# EAGLE design knuckleboard (EAGLE 6.1)
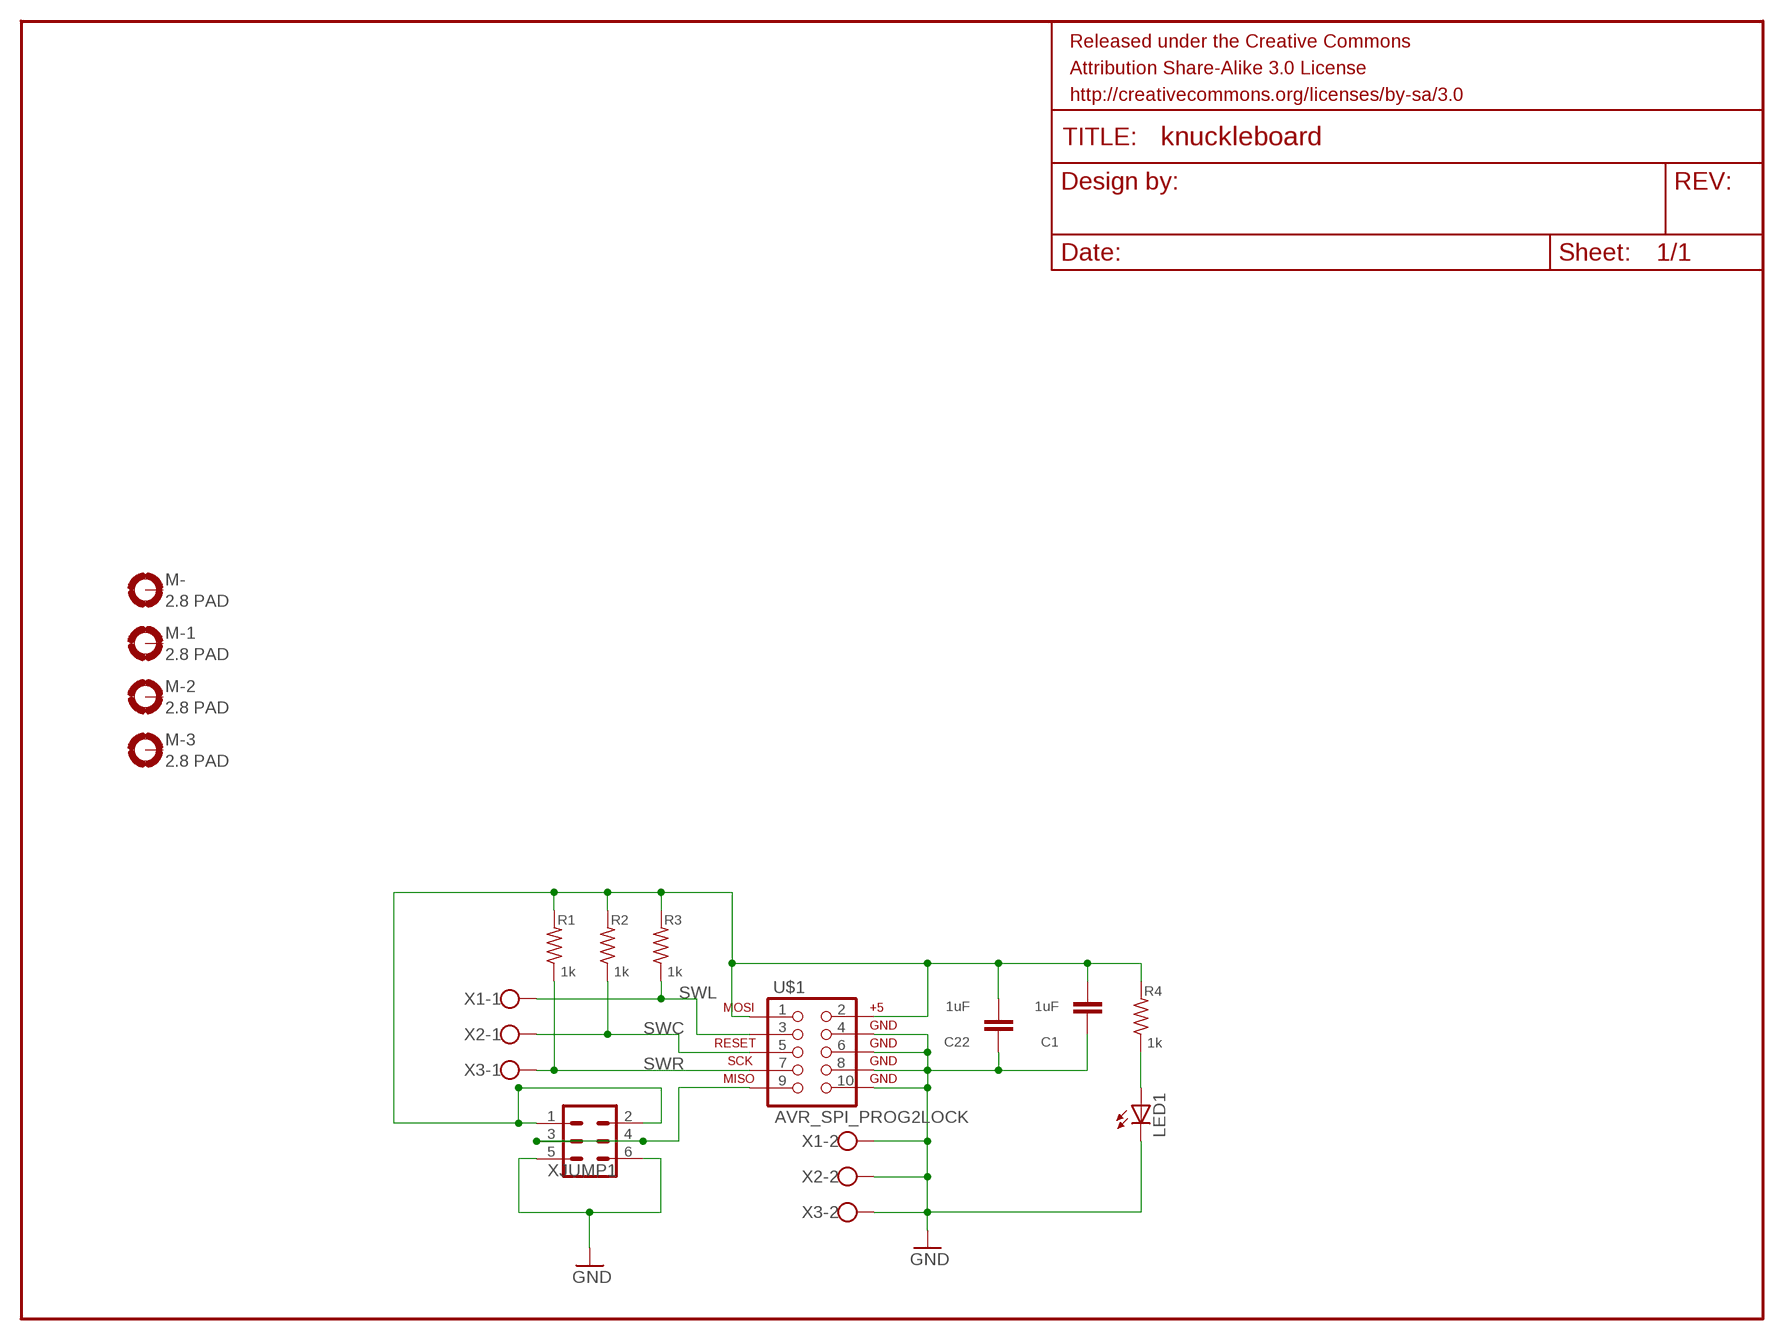
[diagram p0: schematic, sheet 1]

## Parts
C1  1uF  C-EUC1206  [C1206]
C22  1uF  C-EUC1206  [C1206]
LED1  LEDCHIPLED_1206  [CHIPLED_1206]
M-  2.8 PAD  MOUNT-PAD-ROUND2.8  [2,8-PAD]
M-1  2.8 PAD  MOUNT-PAD-ROUND2.8  [2,8-PAD]
M-2  2.8 PAD  MOUNT-PAD-ROUND2.8  [2,8-PAD]
M-3  2.8 PAD  MOUNT-PAD-ROUND2.8  [2,8-PAD]
R1  1k  R-US_M1206  [M1206]
R2  1k  R-US_M1206  [M1206]
R3  1k  R-US_M1206  [M1206]
R4  1k  R-US_M1206  [M1206]
U$1  AVR_SPI_PROG2LOCK  [2X5-SHROUDED_LOCK]
X1  W237-102  [W237-102]
X2  W237-102  [W237-102]
X3  W237-102  [W237-102]
XJUMP1  MA03-2  [MA03-2]

## Nets
GND: C1.1 C22.1 LED1.C U$1.4 U$1.6 U$1.8 U$1.10 X1.2 X2.2 X3.2 XJUMP1.5 XJUMP1.6
N$1: LED1.A R4.1
N$6: U$1.9 XJUMP1.3 XJUMP1.4
SWC: R2.1 U$1.5 X2.1
SWL: R3.1 U$1.3 X1.1
SWR: R1.1 U$1.7 X3.1
VDD5V: C1.2 C22.2 R1.2 R2.2 R3.2 R4.2 U$1.1 U$1.2 XJUMP1.1 XJUMP1.2
Unconnected: M-1.B2,8(MOUNT) M-2.B2,8(MOUNT) M-3.B2,8(MOUNT) M-.B2,8(MOUNT)

## Library data of the parts
C1 C22 = rcl:C-EU: CAPACITOR, European symbol
LED1 = led:LED: LED OSRAM: - CHIPLED LG R971, LG N971, LY N971, LG Q971, LY Q971, LO R971, LY R971 LH N974, LH R974 LS Q976, LO Q976, LY Q976 LO Q996 - Hyper CHIPLED LW Q18S LB Q993, LB Q99A, LB R99A - SideLED LS A670, LO A670, LY A670, LG A670, LP A670 LB A673, LV A673, LT A673, LW A673 LH A674 LY A675 LS A676, LA A676, LO A676, LY A676, LW A676 LS A679, LY A679, LG A679 - Hyper Micro SIDELED® LS Y876, LA Y876, LO Y876, LY Y876 LT Y87S - SmartLED LW L88C, LW L88S LB L89C, LB L89S, LG L890 LS L89K, LO L89K, LY L89K LS L896, LA L896, LO L896, LY L896 - TOPLED LS T670, LO T670, LY T670, LG T670, LP T670 LSG T670, LSP T670, LSY T670, LOP T670, LYG T670 LG T671, LOG T671, LSG T671 LB T673, LV T673, LT T673, LW T673 LH T674 LS T676, LA T676, LO T676, LY T676, LB T676, LH T676, LSB T676, LW T676 LB T67C, LV T67C, LT T67C, LS T67K, LO T67K, LY T67K, LW E67C LS E67B, LA E67B, LO E67B, LY E67B, LB E67C, LV E67C, LT E67C LW T67C LS T679, LY T679, LG T679 LS T770, LO T770, LY T770, LG T770, LP T770 LB T773, LV T773, LT T773, LW T773 LH T774 LS E675, LA E675, LY E675, LS T675 LS T776, LA T776, LO T776, LY T776, LB T776 LHGB T686 LT T68C, LB T68C - Hyper Mini TOPLED® LB M676 - Mini TOPLED Santana® LG M470 LS M47K, LO M47K, LY M47K Source: http://www.osram.convergy.de LUXEON: - LUMILED® LXK2-PW12-R00, LXK2-PW12-S00, LXK2-PW14-U00, LXK2-PW14-V00 LXK2-PM12-R00, LXK2-PM12-S00, LXK2-PM14-U00 LXK2-PE12-Q00, LXK2-PE12-R00, LXK2-PE12-S00, LXK2-PE14-T00, LXK2-PE14-U00 LXK2-PB12-K00, LXK2-PB12-L00, LXK2-PB12-M00, LXK2-PB14-N00, LXK2-PB14-P00, LXK2-PB14-Q00 LXK2-PR12-L00, LXK2-PR12-M00, LXK2-PR14-Q00, LXK2-PR14-R00 LXK2-PD12-Q00, LXK2-PD12-R00, LXK2-PD12-S00 LXK2-PH12-R00, LXK2-PH12-S00 LXK2-PL12-P00, LXK2-PL12-Q00, LXK2-PL12-R00 Source: www.luxeon.com KINGBRIGHT: KA-3528ASYC Source: www.kingbright.com
M- M-1-M-3 = holes:MOUNT-PAD-ROUND: MOUNTING PAD, round
R1-R4 = rcl:R-US_: RESISTOR, American symbol
U$1 = SparkFun-Connectors:AVR_SPI_PROG2: AVR 10-pin ICSP Header This is the standard AVR In Circuit Serial Programming header. Minimal, but includes pin one indicator. Works with standard Olimex programmers. Also look for the 6-pin reduced version. Spark Fun Electronics SKU: PRT-00778
X1-X3 = con-wago-500:W237-102: WAGO SCREW CLAMP
XJUMP1 = con-lstb:MA03-2: PIN HEADER

## Board
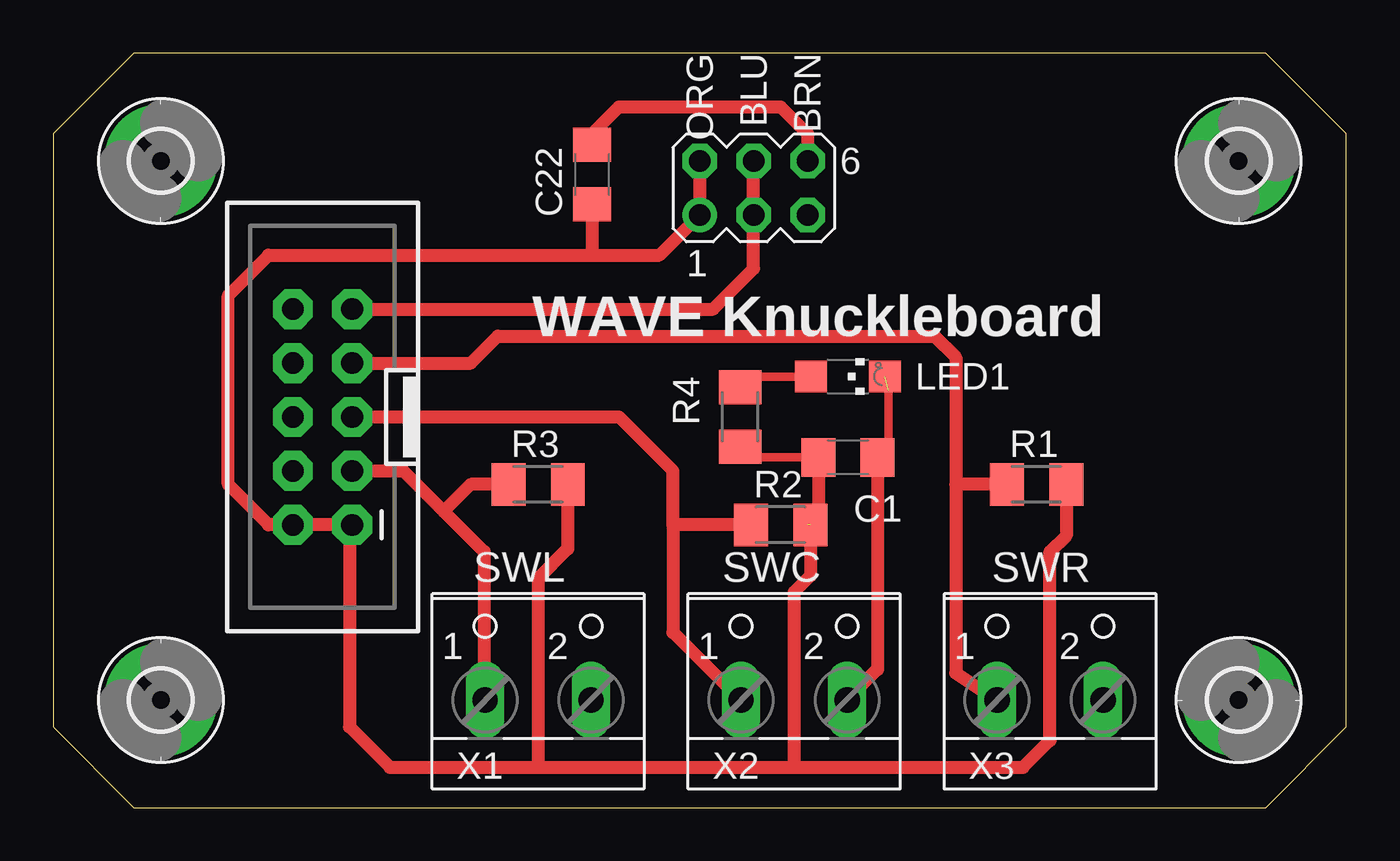
[diagram p1: board, top side]
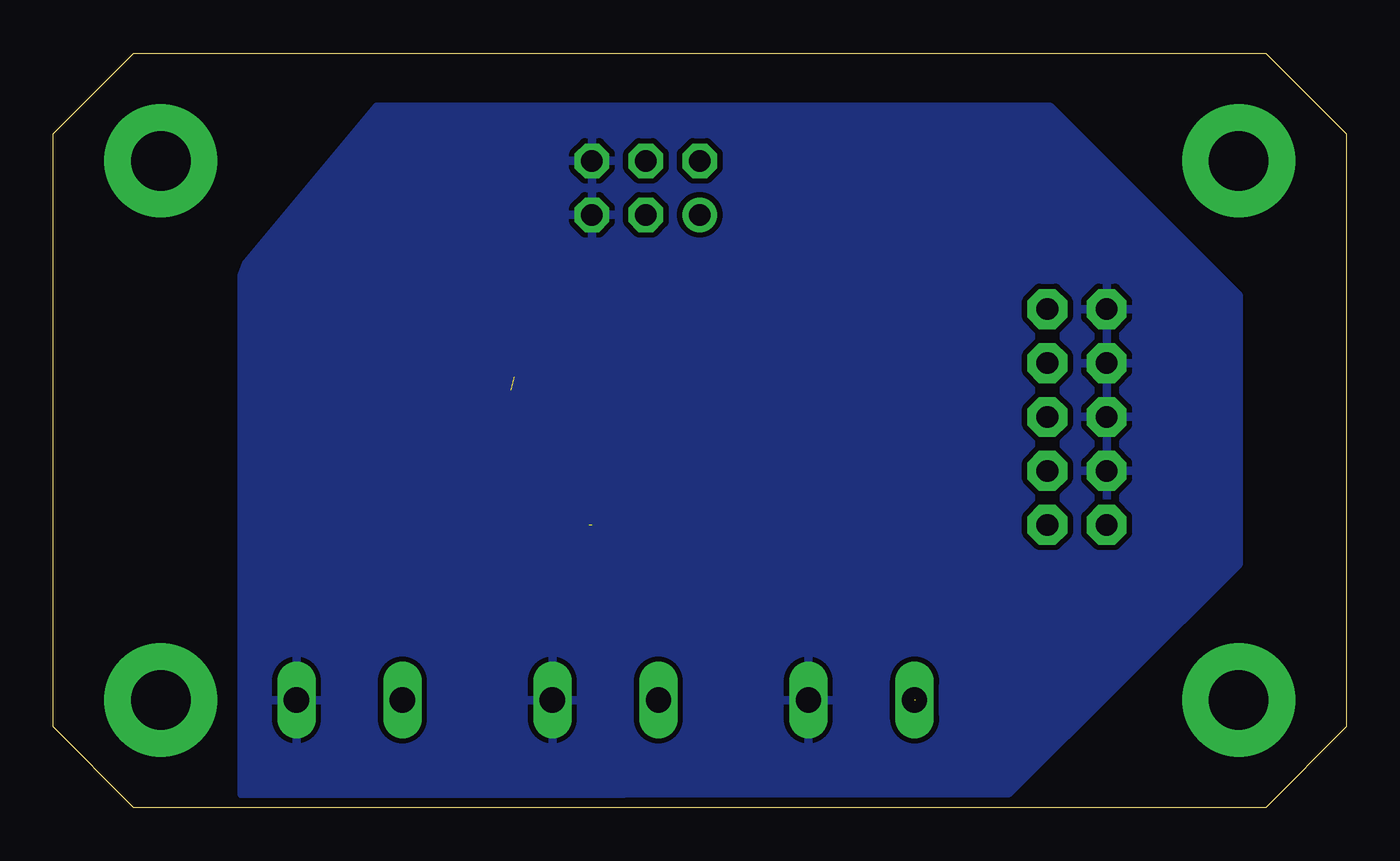
[diagram p2: board, bottom side, seen from below]

Size 60.96 x 35.56 mm. Coordinates in mm from the lower left corner, seen from the top.
Outline: 0,31.75 0,3.81 3.81,0 57.15,0 60.96,3.81 60.96,31.75 57.15,35.56 3.81,35.56 0,31.75
Copper layers (1*16): Top 0.035mm / dielectric 1.5mm / Bottom 0.035mm
Design rules: minimum track width 8mil, minimum drill 20mil, track to track 8mil, track to pad 8mil, pad to pad 8mil, via to via 8mil, smd to smd 8mil, copper to edge 10mil, drill to drill 8mil, minimum pad ring 12mil, minimum via ring 10mil, stop-mask expansion 4mil, vias tented up to drill 25mil, thermal gap 10mil

### Footprints (pad centres in the part's own frame; a part is rotated, then mirrored left to right if it is on the bottom)
C1206 = smd 1.6 x 1.8: 1 -1.4,0; 2 1.4,0
CHIPLED_1206 = smd 1.5 x 1.5: A 0,-1.75; C 0,1.75
2,8-PAD = drill 2.8 pad 5.334: B2,8 0,0
M1206 = smd 1.6 x 2: 1 -1.4,0; 2 1.4,0
2X5-SHROUDED_LOCK = drill 1.016 pad 1.88 octagon: 1 -1.397,5.08; 2 1.397,5.08; 3 -1.397,2.54; 4 1.397,2.54; 5 -1.397,0; 6 1.397,0; 7 -1.397,-2.54; 8 1.397,-2.54; 9 -1.397,-5.08; 10 1.397,-5.08
W237-102 = drill 1.194 long: 1 -2.5,-1.27; 2 2.5,-1.27
MA03-2 = drill 1.016: 1 -2.54,-1.27 | drill 1.016 octagon: 2 -2.54,1.27; 3 0,-1.27; 4 0,1.27; 5 2.54,-1.27; 6 2.54,1.27

### Placement (x,y rotation side)
C1  37.47,16.51 180 top
C22  25.4,29.84 270 top
LED1  37.47,20.32 270 top
M-  5.08,30.48 180 top
M-1  55.88,30.48 0 top
M-2  5.08,5.08 0 top
M-3  55.88,5.08 90 top
R1  46.35,15.24 0 top
R2  34.29,13.34 0 top
R3  22.86,15.24 0 top
R4  32.38,18.41 270 top
U$1  12.7,18.41 180 top
X1  22.86,6.35 0 top
X2  34.92,6.35 0 top
X3  46.99,6.35 0 top
XJUMP1  33.02,29.21 0 top

### Tracks (layer width: path | path; a pad name or v marks a point on that pad's centre or on a via)
GND  (1 unrouted)
  Top 0.406: C1.1 39.37,17.14 39.37,19.68
  Top 0.61: C22.1 25.4,31.75 26.67,33.02 34.29,33.02 35.56,31.75 XJUMP1.6 | C1.1 38.87,6.52 X2.2
  pour Bottom (isolate 0.254): 52.07,0.64 15.93,0.69 5.08,11.49 5.08,24.13 13.97,33.02 45.72,33.02 51.84,25.68 52.07,25.04
N$1
  Top 0.406: LED1.A 32.38,20.32 32.38,19.68 R4.1
N$6
  Top 0.61: U$1.9 31.11,23.5 33.02,25.4 XJUMP1.3 XJUMP1.4
SWC
  Top 0.61: U$1.5 26.67,18.41 29.21,15.88 29.21,13.34 | 29.21,13.34 29.21,8.26 29.25,8.26 X2.1 | R2.1 29.21,13.34
SWL  (1 unrouted)
  Top 0.61: U$1.3 16.51,15.88 18.41,13.97 | 20.32,5.08 20.32,12.06 18.41,13.97 | R3.1 19.68,15.24 18.41,13.97
SWR
  Top 0.61: U$1.7 19.68,20.95 20.95,22.23 41.55,22.23 42.55,21.23 42.55,15.24 | 42.55,15.24 42.55,6.35 42.59,6.35 X3.1 | R1.1 42.55,15.24
VDD5V  (1 unrouted)
  Top 0.406: C1.2 31.75,16.51 32.38,17.14 R4.2
  Top 0.61: U$1.1 U$1.2 | U$1.1 10.16,13.34 8.26,15.24 8.26,24.13 10.16,26.04 25.4,26.04 | 25.4,26.04 28.57,26.04 XJUMP1.1 XJUMP1.2 | U$1.1 13.97,13.21 13.97,3.81 15.88,1.91 22.86,1.91 | 22.86,1.91 34.92,1.91 | 34.92,1.91 45.72,1.91 46.99,3.17 46.99,12.06 47.76,12.83 R1.2 | R2.2 35.69,10.93 34.92,10.16 34.92,1.91 | R3.2 24.26,12.2 22.86,10.79 22.86,1.91 | C22.2 25.4,26.04 | C1.2 36.06,13.84 35.56,13.34

### Text on the board
tNames: ORG | BLU | BRN | WAVE Knuckleboard | SWL | SWC | SWR